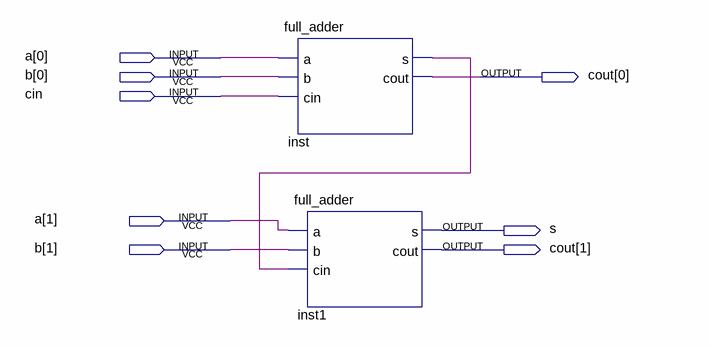
[diagram p0: schematic sheet]
// Quartus schematic full_adder2.bdf as structural Verilog: 2 symbols, 8 pins
module full_adder2 (
  input  [1:0] a,
  input  [1:0] b,
  input  cin,
  output [1:0] cout,
  output s
);

  wire inst_s;

  full_adder inst (.a(a[0]), .b(b[0]), .cin(cin), .s(inst_s), .cout(cout[0]));
  full_adder inst1 (.a(a[1]), .b(b[1]), .cin(inst_s), .s(s), .cout(cout[1]));
endmodule
